# Altium project VCB20.PrjPCB (part 1 of 2)
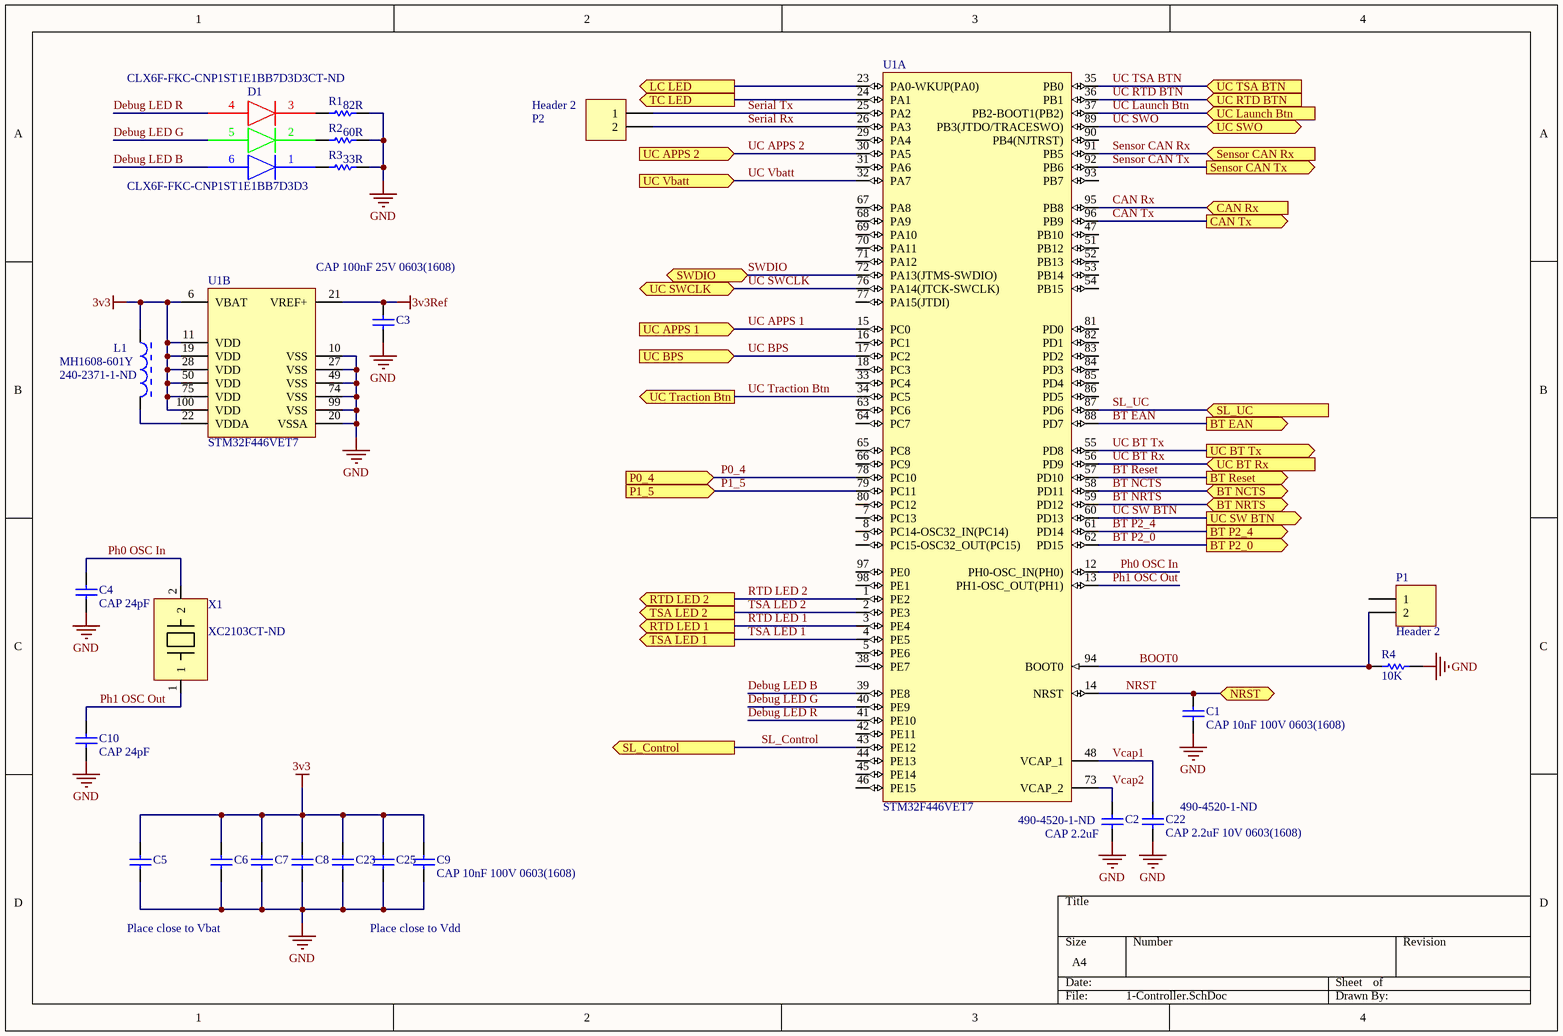
[diagram p0: 1-Controller.SchDoc]
10 sheets, 164 parts. Net scope: flat (ports and power ports of the same name join across sheets).
Board file: VCB2020_rev1.PcbDoc
Sheets:
  1-Controller.SchDoc
  2-Power.SchDoc
  4-PPS.SchDoc
  5-Connector.SchDoc
  8-Bluetooth.SchDoc
  9-Other_Inputs.SchDoc
  10-DashLEDs.SchDoc
  12-Dash_Inputs.SchDoc
  13-Fusing.SchDoc
  14-RegenSolenoid.SchDoc

## Sheet 1-Controller.SchDoc
size A4

### Parts
C1  CAP 10nF 100V 0603(1608)  [CAPC0603(1608)100_M]
C2  CAP 2.2uF  Supplier Part Number 1: 490-4520-1-ND  [CAPC0603(1608)55_N]
C3  CAP 100nF 25V 0603(1608)  [CAPC0603(1608)100_N]
C4  CAP 24pF  [CAPC0603(1608)100_N]
C5  CAP 10nF 100V 0603(1608)  [CAPC0603(1608)100_M]  (value not drawn)
C6  CAP 10nF 100V 0603(1608)  [CAPC0603(1608)100_M]  (value not drawn)
C7  CAP 10nF 100V 0603(1608)  [CAPC0603(1608)100_M]  (value not drawn)
C8  CAP 10nF 100V 0603(1608)  [CAPC0603(1608)100_M]  (value not drawn)
C9  CAP 10nF 100V 0603(1608)  [CAPC0603(1608)100_M]
C10  CAP 24pF  [CAPC0603(1608)100_N]
C22  CAP 2.2uF 10V 0603(1608)  Supplier Part Number 1: 490-4520-1-ND  [CAPC0603(1608)55_N]
C23  CAP 10nF 100V 0603(1608)  [CAPC0603(1608)100_M]  (value not drawn)
C25  CAP 10nF 100V 0603(1608)  [CAPC0603(1608)100_M]  (value not drawn)
D1  CLX6F-FKC-CNP1ST1E1BB7D3D3  Supplier Part Number 1: CLX6F-FKC-CNP1ST1E1BB7D3D3CT-ND  [CLX6C-FKB]
L1  MH1608-601Y  Supplier Part Number 1: 240-2371-1-ND  [BOUR-MH1608_V]
P1  Header 2  [HDR1X2]
P2  Header 2  [HDR1X2]
R1  82R  [RESC0603(1608)_N]
R2  60R  [RESC0603(1608)_N]
R3  33R  [RESC0603(1608)_N]
R4  10K  [RESC0603(1608)_N]
U1  STM32F446VET7  [STM-LQFP100_L]  (parts A,B of 2)
X1  Supplier Part Number 1: XC2103CT-ND  [2-SMD, No Lead]  (hidden comment: 7A-8.000MAAJ-T)

### Ports
BT EAN (out), BT NCTS (bidir), BT NRTS (bidir), BT P2_0 (out), BT P2_4 (out), BT Reset (out), CAN Rx (in), CAN Tx (out), LC LED (out), NRST (bidir), P0_4 (in), P1_5 (in), RTD LED 1 (out), RTD LED 2 (out), Sensor CAN Rx (in), Sensor CAN Tx (out), SL_Control (out), SL_UC (in), SWDIO (bidir), TC LED (out), TSA LED 1 (out), TSA LED 2 (out), UC APPS 1 (in), UC APPS 2 (in), UC BPS (in), UC BT Rx (in), UC BT Tx (out), UC Launch Btn (in), UC RTD BTN (in), UC SW BTN (out), UC SWCLK (bidir), UC SWO (bidir), UC Traction Btn (out), UC TSA BTN (in), UC Vbatt (in)

### Nets
3v3: C5.2 C6.2 C7.2 C8.2 C9.2 C23.2 C25.2 L1.1 U1.6(VBAT) U1.11(VDD) U1.19(VDD) U1.28(VDD) U1.50(VDD) U1.75(VDD) U1.100(VDD)
3v3Ref: C3.2 U1.21(VREF+)
GND: C1.1 C2.1 C3.1 C4.1 C5.1 C6.1 C7.1 C8.1 C9.1 C10.1 C22.1 C23.1 C25.1 R1.2 R2.2 R3.2 R4.2 U1.10(VSS) U1.20(VSSA) U1.27(VSS) U1.49(VSS) U1.74(VSS) U1.99(VSS)
BOOT0: P1.2 R4.1 U1.94(BOOT0)
BT EAN: U1.88(PD7) ; port BT EAN
BT NCTS: U1.58(PD11) ; port BT NCTS
BT NRTS: U1.59(PD12) ; port BT NRTS
BT P2_0: U1.62(PD15) ; port BT P2_0
BT P2_4: U1.61(PD14) ; port BT P2_4
BT Reset: U1.57(PD10) ; port BT Reset
CAN Rx: U1.95(PB8) ; port CAN Rx
CAN Tx: U1.96(PB9) ; port CAN Tx
Debug LED B: D1.6(B) U1.39(PE8)
Debug LED G: D1.5(G) U1.40(PE9)
Debug LED R: D1.4(R) U1.41(PE10)
LC LED: U1.23(PA0-WKUP(PA0)) ; port LC LED
NRST: C1.2 U1.14(NRST) ; port NRST
P0_4: U1.78(PC10) ; port P0_4
P1_5: U1.79(PC11) ; port P1_5
Ph0 OSC In: C4.2 U1.12(PH0-OSC_IN(PH0)) X1.2
Ph1 OSC Out: C10.2 U1.13(PH1-OSC_OUT(PH1)) X1.1
RTD LED 1: U1.3(PE4) ; port RTD LED 1
RTD LED 2: U1.1(PE2) ; port RTD LED 2
Sensor CAN Rx: U1.91(PB5) ; port Sensor CAN Rx
Sensor CAN Tx: U1.92(PB6) ; port Sensor CAN Tx
Serial Rx: P2.2 U1.26(PA3)
Serial Tx: P2.1 U1.25(PA2)
SL_Control: U1.43(PE12) ; port SL_Control
SL_UC: U1.87(PD6) ; port SL_UC
SWDIO: U1.72(PA13(JTMS-SWDIO)) ; port SWDIO
TC LED: U1.24(PA1) ; port TC LED
TSA LED 1: U1.4(PE5) ; port TSA LED 1
TSA LED 2: U1.2(PE3) ; port TSA LED 2
UC APPS 1: U1.15(PC0) ; port UC APPS 1
UC APPS 2: U1.30(PA5) ; port UC APPS 2
UC BPS: U1.17(PC2) ; port UC BPS
UC BT Rx: U1.56(PD9) ; port UC BT Rx
UC BT Tx: U1.55(PD8) ; port UC BT Tx
UC Launch Btn: U1.37(PB2-BOOT1(PB2)) ; port UC Launch Btn
UC RTD BTN: U1.36(PB1) ; port UC RTD BTN
UC SW BTN: U1.60(PD13) ; port UC SW BTN
UC SWCLK: U1.76(PA14(JTCK-SWCLK)) ; port UC SWCLK
UC SWO: U1.89(PB3(JTDO/TRACESWO)) ; port UC SWO
UC Traction Btn: U1.34(PC5) ; port UC Traction Btn
UC TSA BTN: U1.35(PB0) ; port UC TSA BTN
UC Vbatt: U1.32(PA7) ; port UC Vbatt
Vcap1: C22.2 U1.48(VCAP_1)
Vcap2: C2.2 U1.73(VCAP_2)
NetD1_1: D1.1(B) R3.1
NetD1_2: D1.2(G) R2.1
NetD1_3: D1.3(R) R1.1
NetL1_2: L1.2 U1.22(VDDA)

Not connected (* = marked no-connect by the designer): P1 1; U1 5(PE6) 7(PC13) 8(PC14-OSC32_IN(PC14)) 9(PC15-OSC32_OUT(PC15)) 16(PC1) 18(PC3) 29(PA4) 31(PA6) 33(PC4) 38(PE7) 42(PE11) 44(PE13) 45(PE14) 46(PE15) 47(PB10) 51(PB12) 52(PB13) 53(PB14) 54(PB15) 63(PC6) 64(PC7) 65(PC8) 66(PC9) 67(PA8) 68(PA9) 69(PA10) 70(PA11) 71(PA12) 77(PA15(JTDI)) 80(PC12) 81(PD0) 82(PD1) 83(PD2) 84(PD3) 85(PD4) 86(PD5) 90(PB4(NJTRST)) 93(PB7) 97(PE0) 98(PE1)

### Notes on the sheet
- Place close to Vbat
- Place close to Vdd

### Library data of the parts
C1 C5-C9 C23 C25 = CMP-1035-02326-1: CAP 10nF 100V ±20% 0603 (1608 Metric) Thickness 1mm SMD; Case-EIA: 0603; Tolerance: Â±20%; Case-Metric: 1608; Max Thickness: 1 mm; Technology: SMT; Value: 10nF; Rated Voltage: 100 V
C2 C22 = CMP-1035-02757-1: CAP 2.2uF 10V ±10% 0603 (1608 Metric) Thickness 0.55mm SMD; Case-EIA: 0603; Case-Metric: 1608; Tolerance: Â±10%; Value: 2.2uF; Rated Voltage: 10 V; Technology: SMT; Max Thickness: 0.55 mm; Supplier 1: Digi-Key
C3 = CMP-1035-02589-1: CAP 100nF 25V ±20% 0603 (1608 Metric) Thickness 1mm SMD; Case-EIA: 0603; Tolerance: Â±20%; Case-Metric: 1608; Value: 100nF; Max Thickness: 1 mm; Technology: SMT; Rated Voltage: 25 V
C4 C10 = CMP-1035-00843-1: CAP 24pF 16V ±2% 0603 (1608 Metric) Thickness 1mm SMD; Tolerance: Â±2%; Case-Metric: 1608; Case-EIA: 0603; Value: 24pF; Technology: SMT; Rated Voltage: 16 V; Max Thickness: 1 mm
D1 = LED - CLX6F-FKC-CNP1ST1E1BB7D3D3: Red, Green, Blue (RGB) 622nm Red, 530nm Green, 470nm Blue LED Indication - Discrete 2.1V Red, 2.7V Green, 3V Blue 6-SMD, J-Lead; ComponentLink1Description: Digikey; ComponentLink1URL: https://www.digikey.ca/product-detail/en/cree-inc/CLX6F-FKC-CNP1ST1E1BB7D3D3/CLX6F-FKC-CNP1ST1E1BB7D3D3CT-ND/6362814; Supplier 1: Digi-Key
L1 = CMP-2000-06698-1: Chip Bead, 600 Ohm, 1 A, -55 to 125 degC, 2-Pin SMD (0603), RoHS, Tape and Reel; Manufacturer: Bourns; Impedance @ Frequency: 600Ohm@100MHz; Online Catalog: MHSeries; DC Resistance (DCR) (Max): 200mOhm; Current Rating (Max): 1A; Other Names: MH1608-601YCT; EDA / CAD Models: DownloadfromAcceleratedDesigns; Filter Type: Power,SignalLine; Number of Lines: 1; Mounting Type: SurfaceMount; Manufacturer URL: http://www.bourns.com/; Package Description: 2-Pin Surface Mount Device, Body 1.6 x 0.8 mm; Category: Filters; Packaging: CutTape(CT); Family: FerriteBeadsandChips; Datasheet Version: 03/2015; Standard Package: 1; Mounting Technology: SurfaceMount; Package / Case: 0603(1608Metric); Datasheet URL: http://www.bourns.com/docs/Product-Datasheets/mh.pdf; Operating Temperature: -55°C~125°C; RoHS Information: MH1608SeriesMaterialDeclaration; Ratings: -; Package Reference: 0603; Series: MH; Supplier 1: Digi-Key
P1 P2 = Header 2: Header, 2-Pin; LatestRevisionDate: 17-Jul-2002; LatestRevisionNote: Re-released for DXP Platform.; Publisher: Altium Limited
R1 = CMP-1012-00048-1: 82R 0.1W 5% 0603 (1608 Metric)  SMD; Case-Metric: 1608; Value: 82.00 Ohm; Case-EIA: 0603; Technology: SMT; Tolerance: 5 %; Power: 0.1 W
R2 = CMP-1012-00372-1: 60R4 0.1W 1% 0603 (1608 Metric)  SMD; Case-EIA: 0603; Value: 60.40 Ohm; Case-Metric: 1608; Technology: SMT; Tolerance: 1 %; Power: 0.1 W
R3 = CMP-1012-00038-1: 33R 0.1W 5% 0603 (1608 Metric)  SMD; Value: 33.00 Ohm; Case-EIA: 0603; Case-Metric: 1608; Tolerance: 5 %; Technology: SMT; Power: 0.1 W
R4 = CMP-1012-00098-1: 10K 0.1W 5% 0603 (1608 Metric)  SMD; Case-EIA: 0603; Value: 10000.00 Ohm; Case-Metric: 1608; Technology: SMT; Tolerance: 5 %; Power: 0.1 W
U1 = CMP-0243-00221-1: ARM Cortex-M4 32-bit MCU+FPU, 512 KB Flash, 128 KB Internal RAM, 81 I/Os, 100-Pin LQFP, -40 to 105 degC, Tray; Supply Voltage(Vcc) min (V): 1.7; Operating Frequency(F) (Processor speed) (MHz): 180; D/A Converter: 2; FLASH Size (Prog) (kB): 512; I/Os (High Current): 81; Internal RAM Size (kB): 128; Core: ARM Cortex-M4; Packing: Tray; ComponentLink1URL: http://www.st.com/; DatasheetVersion: Rev. 6; Mounting Technology: Surface Mount; ComponentLink2Description: Datasheet; ComponentLink2URL: http://www.st.com/st-web-ui/static/active/en/resource/technical/document/datasheet/DM00141306.pdf; Package Reference: 100-Pin Low Profile Quad Flat Package, Body 14 x 14 mm, Pitch 0.5 mm; ComponentLink1Description: Manufacturer URL; Package Description: LQFP100; PartId: 1
X1 = 8MHz crystal, 7A-8.000MAAJ-T: Manufacturer: TXC CORPORATION; Frequency: 8MHz; Frequency Stability: ±30ppm; Load Capacitance: 18pF; ESR (Equivalent Series Resistance): 80 Ohm; Operating Mode: Fundamental; Manufacturer Part Number: 7A-8.000MAAJ-T; RoHS: RoHS Compliant; Category: Crystals, Oscillators, Resonators; Stock 1: 30692; Pricing 1: 1=1.12, 10=0.989, 50=0.9234, 100=0.8162, 500=0.77322 (CAD); Packaging: Cut Tape (CT); Part Status: Active; Type: MHz Crystal; Frequency Tolerance: ±30ppm; Operating Temperature: -20°C ~ 70°C; Ratings: -; Mounting Type: Surface Mount; Package / Case: 2-SMD, No Lead; Size / Dimension: 0.197" L x 0.126" W (5.00mm x 3.20mm); Height - Seated (Max): 0.053" (1.35mm); ComponentLink1URL: http://www.txccrystal.com/images/pdf/7a.pdf; ComponentLink1Description: http://www.txccrystal.com/images/pdf/7a.pdf; Supplier 1: Digi-Key

## Sheet 2-Power.SchDoc
size A4
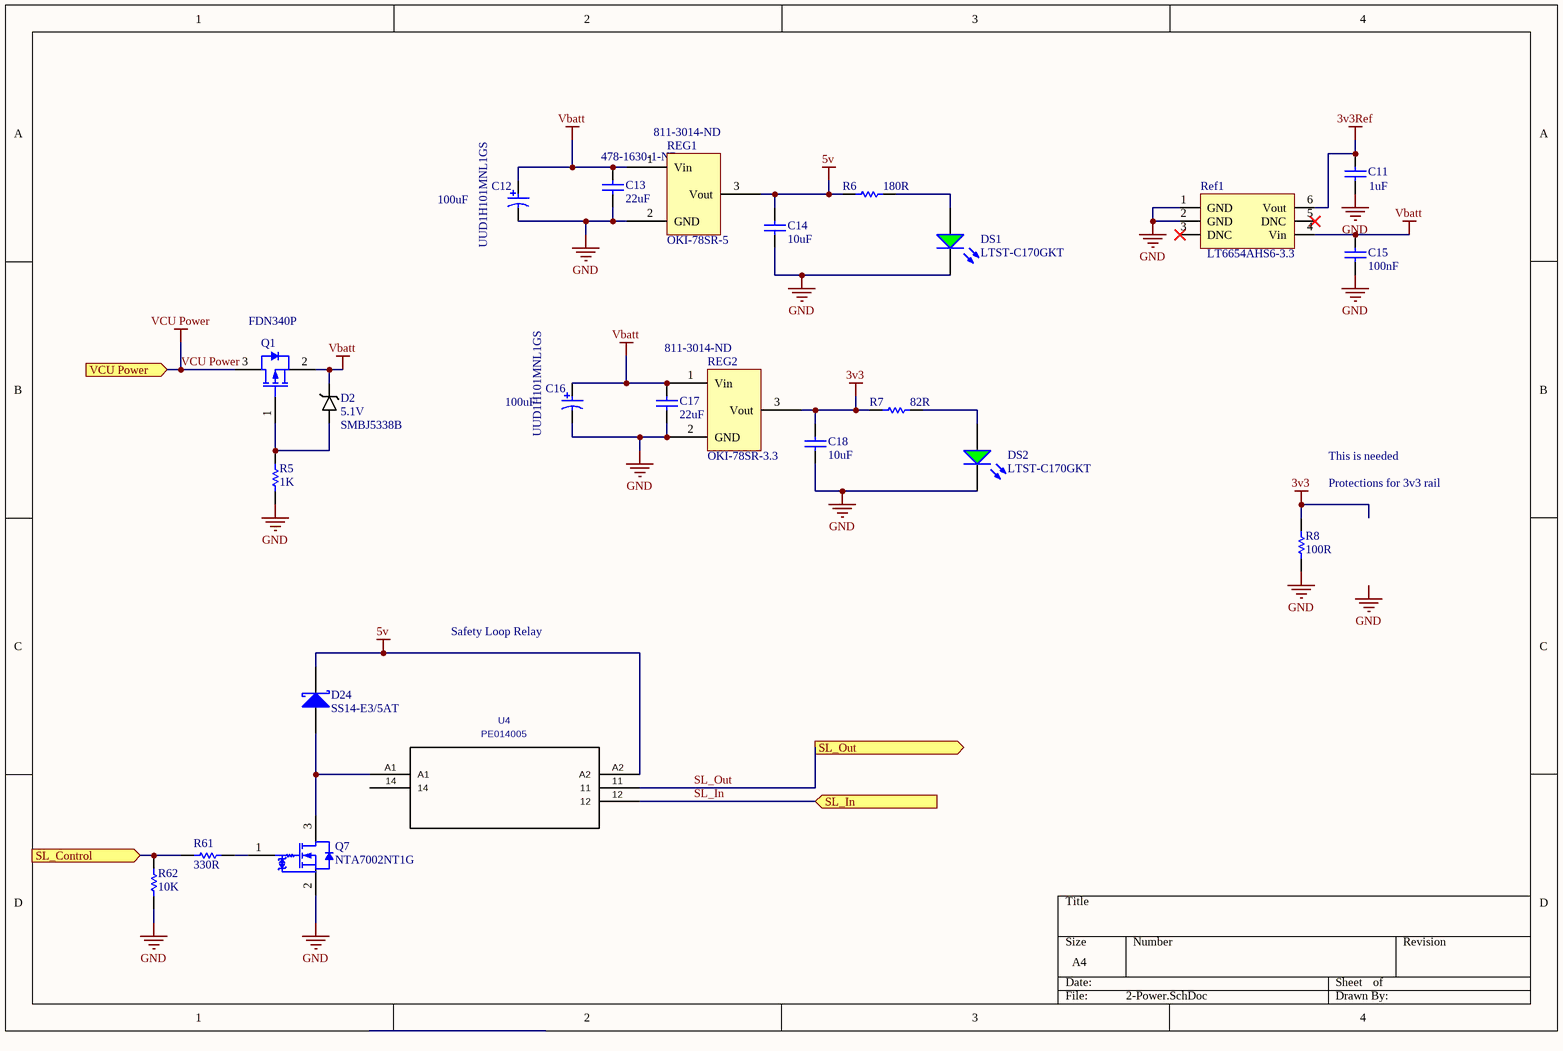
[diagram p1: 2-Power.SchDoc]

### Parts
C11  value 1uF  [1608[0603]]  (hidden comment: Cap)
C12  UUD1H101MNL1GS  [NIC-CAPA2-8X10_V]
C13  value 22uF  Supplier Part Number 1: 478-1630-1-ND  [C1210_M]  (hidden comment: Cap)
C14  value 10uF  [C1210_M]  (hidden comment: Cap)
C15  value 100nF  [1608[0603]]  (hidden comment: Cap)
C16  UUD1H101MNL1GS  [NIC-CAPA2-8X10_V]
C17  value 22uF  [C1210_M]  (hidden comment: Cap)
C18  value 10uF  [C1210_M]  (hidden comment: Cap)
D2  Reverse Voltage: 5.1V  Part Number: SMBJ5338B  [DO-214AA (SMB)]  (hidden comment: Zener Diode, 5.1V, 5W SMBJ5338B)
D24  SS14-E3/5AT  [VISH-DO-214AC-2_V]
DS1  LTST-C170GKT  [LTST-C170GKT_V]
DS2  LTST-C170GKT  [LTST-C170GKT_V]
Q1  FDN340P  [FAIR-SSOT3L-3_V]
Q7  NTA7002NT1G  [ONSC-SC-75-3-463-01_V]
R5  value 1K  [1608[0603]]  (hidden comment: Res1)
R6  value 180R  [1608[0603]]  (hidden comment: Res1)
R7  value 82R  [1608[0603]]  (hidden comment: Res1)
R8  100R  [RESC1206(3216)_M]
R61  value 330R  [1608[0603]]  (hidden comment: Res1)
R62  value 10K  [1608[0603]]  (hidden comment: Res1)
Ref1  LT6654AHS6-3.3  [TSOT-23 S6]
REG1  OKI-78SR-5  Supplier Part Number 2: 811-3014-ND  [OKI-78SR-5/1.5-W - Horizontal]
REG2  OKI-78SR-3.3  Supplier Part Number 2: 811-3014-ND  [Reg - TH, 3 pin, 100 mil Pitch, VTL]
U4  PE014005  [PE014005]

### Ports
SL_Control (in), SL_In (in), SL_Out (out), VCU Power (in)

### Nets
3v3: C18.2 R7.1 R8.2 REG2.3(Vout)
3v3Ref: C11.2 Ref1.6(Vout)
5v: C14.2 D24.2(K) R6.1 REG1.3(Vout) U4.A2
GND: C11.1 C12.2 C13.1 C14.1 C15.1 C16.2 C17.1 C18.1 DS1.2(K) DS2.2(K) Q7.2(S) R5.1 R8.1 R62.1 Ref1.1(GND) Ref1.2(GND) REG1.2(GND) REG2.2(GND)
Vbatt: C12.1 C13.2 C15.2 C16.1 C17.2 D2.K Q1.2(SOURCE) Ref1.4(Vin) REG1.1(Vin) REG2.1(Vin)
VCU Power: Q1.3(DRAIN) ; port VCU Power
SL_Control: R61.2 R62.2 ; port SL_Control
SL_In: U4.12 ; port SL_In
SL_Out: U4.11 ; port SL_Out
NetD2_A: D2.A Q1.1(GATE) R5.2
NetD24_1: D24.1(A) Q7.3(D) U4.A1
NetDS1_1: DS1.1(A) R6.2
NetDS2_1: DS2.1(A) R7.2
NetQ7_1: Q7.1(G) R61.1

Not connected (* = marked no-connect by the designer): Ref1 3(DNC)* 5(DNC)*; U4 14

### Notes on the sheet
- (near C12) 100uF
- (near C16) 100uF
- (near R8) Protections for 3v3 rail
- This is needed
- Safety Loop Relay
- Labels drawn without touching a wire or pin: GND

### Library data of the parts
C11 = Cap: Capacitor; Manufacturer: Murata Electronics North America; Manufacturer Part Number: GRM188R61E105KA12D; Capacitance: 1µF; Tolerance: ±10%; Voltage - Rated: 25V; Temperature Coefficient: X5R; RoHS: RoHS Compliant; Category: Capacitors; Stock 1: 4259407; Pricing 1: 1=0.15, 10=0.053, 50=0.0288, 100=0.0242, 250=0.01984, 500=0.01696, 1000=0.0132 (CAD); Packaging: Cut Tape (CT); Part Status: Active; Operating Temperature: -55°C ~ 85°C; Features: -; Ratings: -; Applications: General Purpose; Mounting Type: Surface Mount, MLCC; Package / Case: 0603 (1608 Metric); Size / Dimension: 0.063" L x 0.031" W (1.60mm x 0.80mm); Height - Seated (Max): -; Thickness (Max): 0.035" (0.90mm); Lead Spacing: -; Lead Style: -; ComponentLink1URL: http://www.murata.com/~/media/webrenewal/support/library/catalog/products/capacitor/mlcc/c02e.pdf; ComponentLink1Description: http://www.murata.com/~/media/webrenewal/support/library/catalog/products/capacitor/mlcc/c02e.pdf; Supplier 1: Digi-Key; Supplier Part Number 1: 587-2400-1-ND
C12 C16 = CMP-0687-00073-1: Aluminum Electrolytic Capacitor, UD Series, Low Impedance, 100 uF, 50 V, + / - 20%, -55 to 105 degC, Chip Type, 8 x 10 mm D x L, Pb-Free, Reel; Manufacturer: Nichicon; Rated Ripple Current (at 100kHz): 300 mA; Tolerance Rated Capacitance: -20 to 20%; Packing: Dia382mm Reel; Impedance: 0.34 Ohm; Rated Voltage: 50 V; Endurance Time: 5000 h; Rated Capacitance: 100 uF; Capacitance: 100µF; Voltage Rating: 50V; Lifetime @ Temp.: 5000 Hrs @ 105°C; Polarization: Polar; Ripple Current: 300mA; Surface Mount Land Size: 0.327" L x 0.327" W (8.30mm x 8.30mm); ComponentLink3Description: Package Specification; ComponentLink2Description: Datasheet; PackageReference: CAPAE-D8H10; RoHS: TRUE; Length: 10 mm; Mounting Technology: Surface Mount; PackageDescription: 2-Pin Surface Mount Device, Diameter 8 mm, Height 10 mm, Pitch 6.5 mm; DatasheetVersion: 08/2012; Diameter: 8 mm; ComponentLink3URL: http://products.nichicon.co.jp/en/pdf/XJA043/e-ud.pdf; ComponentLink1Description: Manufacturer URL; PartNumber: UUD1H101MNL1GS; ComponentLink2URL: http://products.nichicon.co.jp/en/pdf/XJA043/e-ud.pdf; ComponentLink1URL: http://www.nichicon.co.jp/; Supplier 1: Digi-Key; Supplier Part Number 1: 493-2306-1-ND; Manufacturer Part Number: UUD1H101MNL1GS; Category: Capacitors; Stock 1: 65948; Pricing 1: 1=0.92, 10=0.685, 25=0.5868, 50=0.5478, 100=0.4696, 250=0.43044 (CAD); Packaging: Cut Tape (CT); Part Status: Active; Tolerance: ±20%; ESR (Equivalent Series Resistance): -; Operating Temperature: -55°C ~ 105°C; Applications: General Purpose; Lead Spacing: -; Size / Dimension: 0.315" Dia (8.00mm); Height - Seated (Max): 0.394" (10.00mm); Mounting Type: Surface Mount; Package / Case: Radial, Can - SMD; ComponentLink4URL: http://nichicon-us.com/english/products/pdfs/e-uud.pdf; ComponentLink4Description: http://nichicon-us.com/english/products/pdfs/e-uud.pdf
C13 C17 = Cap: Capacitor; Manufacturer: Yageo; Manufacturer Part Number: CC1210MKX5R8BB226; Capacitance: 22µF; Tolerance: ±20%; Voltage - Rated: 25V; Temperature Coefficient: X5R; RoHS: RoHS Compliant; Category: Capacitors; Stock 1: 128; Pricing 1: 1=1, 10=0.703, 25=0.5996, 50=0.5314, 100=0.4628, 250=0.39424 (CAD); Packaging: Cut Tape (CT); Part Status: Active; Operating Temperature: -55°C ~ 85°C; Features: -; Ratings: -; Applications: General Purpose; Failure Rate: -; Mounting Type: Surface Mount, MLCC; Package / Case: 1210 (3225 Metric); Size / Dimension: 0.126" L x 0.098" W (3.20mm x 2.50mm); Height - Seated (Max): -; Thickness (Max): 0.110" (2.80mm); Lead Spacing: -; Lead Style: -; ComponentLink1URL: http://www.yageo.com/documents/recent/UPY-GPHC_X5R_4V-to-50V_23.pdf; ComponentLink1Description: http://www.yageo.com/documents/recent/UPY-GPHC_X5R_4V-to-50V_23.pdf; Supplier 1: Digi-Key
  C17: Supplier Part Number 1: 311-2056-1-ND
C14 C18 = Cap: Capacitor; Manufacturer: Yageo; Manufacturer Part Number: CC1210ZKY5V8BB106; Capacitance: 10µF; Tolerance: -20%, +80%; Voltage - Rated: 25V; Temperature Coefficient: Y5V (F); Supplier 1: Digi-Key; Supplier Part Number 1: 311-2063-1-ND; RoHS: RoHS Compliant; Category: Capacitors; Stock 1: 1156; Pricing 1: 1=0.47, 10=0.323, 25=0.258, 50=0.2154, 100=0.1829, 250=0.14528, 500=0.12912, 1000=0.11298 (CAD); Packaging: Cut Tape (CT); Part Status: Active; Operating Temperature: -30°C ~ 85°C; Features: -; Ratings: -; Applications: General Purpose; Failure Rate: -; Mounting Type: Surface Mount, MLCC; Package / Case: 1210 (3225 Metric); Size / Dimension: 0.126" L x 0.098" W (3.20mm x 2.50mm); Height - Seated (Max): -; Thickness (Max): 0.083" (2.10mm); Lead Spacing: -; Lead Style: -; ComponentLink1URL: http://www.yageo.com/documents/recent/UPY-GPHC_Y5V_6.3V-to-50V_7.pdf; ComponentLink1Description: http://www.yageo.com/documents/recent/UPY-GPHC_Y5V_6.3V-to-50V_7.pdf
C15 = Cap: Capacitor; Manufacturer: Yageo; Manufacturer Part Number: CC0603KRX7R9BB104; Capacitance: 0.10µF; Tolerance: ±10%; Voltage - Rated: 50V; Temperature Coefficient: X7R; Supplier 1: Digi-Key; Supplier Part Number 1: 311-1344-1-ND; RoHS: RoHS Compliant; Category: Capacitors; Stock 1: 4016262; Pricing 1: 1=0.15, 10=0.043, 25=0.0312, 50=0.0232, 100=0.0189, 250=0.0158, 500=0.01346, 1000=0.01059 (CAD); Packaging: Cut Tape (CT); Part Status: Active; Operating Temperature: -55°C ~ 125°C; Features: -; Ratings: -; Applications: General Purpose; Failure Rate: -; Mounting Type: Surface Mount, MLCC; Package / Case: 0603 (1608 Metric); Size / Dimension: 0.063" L x 0.031" W (1.60mm x 0.80mm); Height - Seated (Max): -; Thickness (Max): 0.035" (0.90mm); Lead Spacing: -; Lead Style: -; ComponentLink1URL: http://www.yageo.com/documents/recent/UPY-GPHC_X7R_6.3V-to-50V_16.pdf; ComponentLink1Description: http://www.yageo.com/documents/recent/UPY-GPHC_X7R_6.3V-to-50V_16.pdf
D24 = CMP-0549-00004-1: Schottky Barrier Rectifier, 40 V Maximum DC Blocking Voltage, -65 to 125 degC, 2-Pin SMA Case, RoHS; Manufacturer: Vishay Semiconductor; IFSM: 40 A; IF(AV): 1 A Max.; VRRM: 40 V Max.; VRMS: 28 V Max.; PackageReference: DO-214AC-2; RoHS: TRUE; DatasheetVersion: 12/17/2012; ComponentLink1Description: Manufacturer URL; ComponentLink2URL: http://www.vishay.com/docs/88746/ss12.pdf; PartNumber: SS14-E3/5AT; PackageVersion: Dec-12; Operating Temperature: -65 to 125 degC; ComponentLink3URL: http://www.vishay.com/docs/88746/ss12.pdf; PackageDescription: 2-Pin SMD, Body 4.245 x 2.665 mm, Height 2.29 mm; ComponentLink1URL: http://www.vishay.com/; ComponentLink3Description: Package Specification; ComponentLink2Description: Datasheet; Mounting Technology: Surface Mount; VDC: 40 V Max.
DS1 DS2 = CMP-1674-00002-5: LED Uni-Color Green, 100 mW, 120 mA, -55 to 85 degC, 2-Pin SMD, RoHS, Tape and Reel; Manufacturer: Lite-On; Lens Color: Colorless; Lens Transparency: Clear; Millicandela Rating: 6mcd; Lens Style/Size: Rectangle with Flat Top, 1.40mm x 1.25mm; Voltage - Forward (Vf) (Typ): 2.1V; Current - Test: 10mA; Viewing Angle: 130°; Wavelength - Dominant: 569nm; Wavelength - Peak: 565nm; ComponentLink1URL: http://www.us.liteon.com/; Height: 1.1 mm; PackageDescription: 2-Pin Surface Mount Device, Body 2 x 1.25 mm; RoHSCompliant: true; Package Quantity: 1; Packaging: Tape and Reel; Mount: Surface Mount; Min Operating Temperature: -55 degC; DatasheetVersion: 03/2003; Max Operating Temperature: 85 degC; ComponentLink1Description: Manufacturer URL; Pins: 2; Mounting Technology: Surface Mount; Length: 2 mm; Colour: Green; PackageReference: C170GKT; ComponentLink2URL: http://media.digikey.com/pdf/Data%20Sheets/Lite-On%20PDFs/LTST-C170GKT.pdf; ComponentLink2Description: Datasheet; Supplier 1: Digi-Key; Supplier Part Number 1: 160-1179-1-ND; Manufacturer Part Number: LTST-C170GKT; RoHS: RoHS Compliant; Category: Optoelectronics; Stock 1: 242288; Pricing 1: 1=0.48, 10=0.351, 25=0.2588, 100=0.1848, 250=0.12564, 500=0.11086, 1000=0.08684 (CAD); Part Status: Active; Color: Green; Mounting Type: Surface Mount; Features: -; Package / Case: 0805 (2012 Metric); Supplier Device Package: -; Size / Dimension: 2.00mm L x 1.25mm W; Height (Max): 1.10mm
Q1 = CMP-2100-03638-1: Single P-Channel, Logic Level, PowerTrench(R) MOSFET, 2 A, 20 V, -55 to 150 degC, 3-Pin SOT-23, RoHS, Tape and Reel; Manufacturer: Fairchild Semiconductor; Fall Time: 11ns; Current Rating: -2A; Turn-On Delay Time: 10ns; Drain to Source Breakdown Voltage: -20V; Drain to Source Resistance: 60mOhm; Gate to Source Voltage (Vgs): 8V; Threshold Voltage: -800mV; Rds On Max: 70mOhm; Package Version: Rev. 3, 05/2015; Turn-Off Delay Time: 27ns; Power Dissipation: 500mW; Number of Elements: 1; Drain to Source Voltage (Vdss): 20V; Rise Time: 9ns; Input Capacitance: 779pF; Continuous Drain Current (ID): 2A; Radiation Hardening: No; Contact Plating: Tin; Mount: SurfaceMount; REACH SVHC: NoSVHC; Manufacturer URL: https://www.fairchildsemi.com/; Width: 3.05mm; Height: 0.94mm; Voltage Rating (DC): -20V; Package Quantity: 1; Case/Package: SOT-23; Package Reference: SSOT3L; Lead Free: LeadFree; Datasheet Version: Rev. E1, 02/2007; Termination: SMD/SMT; Package URL: https://www.fairchildsemi.com/package-drawings/MA/MA03B.pdf; Packaging: TapeandReel; Number of Pins: 3; RoHSCompliant: true; Datasheet URL: https://www.fairchildsemi.com/datasheets/FD/FDN340P.pdf; Max Operating Temperature: 150degC; Element Configuration: Single; Min Operating Temperature: -55degC; Length: 2.92mm; Package Description: 3-Pin Small Outline Transistor, Body 2.92 x 1.4 mm, Pitch 0.95 mm; Max Power Dissipation: 500mW
Q7 = CMP-1058-00646-1: Small Signal MOSFET, 30 V, 154 mA, Single, N-Channel, Gate ESD Protection, 3-Pin SC75, Pb-Free, Tape and Reel; Manufacturer: On Semiconductor; Coss Typ (pF): 10; Crss Typ (pF): 3.5; Ciss Typ (pF): 11.5; V(BR)DSS Min (V): 30; Channel Polarity: N Channel; VGS(th) Max (V): 1.5; PD Max (W): 0.3; ID Max (A): 0.154; PackageReference: SC-75-3-463-01; ComponentLink3Description: Package Specification; PartNumber: NTA7002NT1G; PackageDescription: 3-Pin Small Outline Transistor, Body 1.6 x 0.8 mm, Pitch 0.5 mm; ComponentLink3URL: http://www.onsemi.com/pub_link/Collateral/463-01.PDF; Package Type: SC-75-3; Packing: Tape and Reel; Configuration: Single; PackageVersion: Rev. F, 07/2005; ComponentLink2Description: Datasheet; ComponentLink1URL: http://www.onsemi.com/; ComponentLink1Description: Manufacturer URL; DatasheetVersion: Rev. 5; VGS Max (V): 10; Mounting Technology: Surface Mount; RoHS: Pb-Free; ComponentLink2URL: http://www.onsemi.cn/pub_link/Collateral/NTA7002N-D.PDF
R5 = Res1: Resistor; Manufacturer: Panasonic Electronic Components; Manufacturer Part Number: ERJ-PA3F1001V; Tolerance: ±1%; Power (Watts): 0.25W, 1/4W; Temperature Coefficient: ±100ppm/°C; Supplier 1: Digi-Key; Supplier Part Number 1: P1.0KBYCT-ND; RoHS: RoHS Compliant; Category: Resistors; Stock 1: 56110; Pricing 1: 1=0.22, 10=0.198, 25=0.138, 50=0.1072, 100=0.0765, 250=0.05972, 500=0.04746, 1000=0.03368 (CAD); Packaging: Cut Tape (CT); Part Status: Active; Resistance (Ohms): 1k; Composition: Thick Film; Features: Automotive AEC-Q200, Pulse Withstanding; Operating Temperature: -55°C ~ 155°C; Package / Case: 0603 (1608 Metric); Supplier Device Package: 0603; Size / Dimension: 0.063" L x 0.031" W (1.60mm x 0.80mm); Height - Seated (Max): 0.022" (0.55mm); Number of Terminations: 2; Failure Rate: -; ComponentLink1URL: https://industrial.panasonic.com/cdbs/www-data/pdf/RDA0000/AOA0000C243.pdf; ComponentLink1Description: https://industrial.panasonic.com/cdbs/www-data/pdf/RDA0000/AOA0000C243.pdf
R6 = Res1: Resistor; Manufacturer: Yageo; Manufacturer Part Number: RC0603JR-07180RL; Resistance (Ohms): 180; Tolerance: ±5%; Power (Watts): 0.1W, 1/10W; Temperature Coefficient: ±100ppm/°C; Supplier 1: Digi-Key; Supplier Part Number 1: 311-180GRCT-ND; RoHS: RoHS Compliant; Category: Resistors; Stock 1: 201936; Pricing 1: 1=0.16, 10=0.016, 25=0.0112, 50=0.0084, 100=0.0062, 250=0.0048, 500=0.00382, 1000=0.00281 (CAD); Packaging: Cut Tape (CT); Part Status: Active; Composition: Thick Film; Features: Moisture Resistant; Operating Temperature: -55°C ~ 155°C; Package / Case: 0603 (1608 Metric); Supplier Device Package: 0603; Size / Dimension: 0.063" L x 0.031" W (1.60mm x 0.80mm); Height - Seated (Max): 0.022" (0.55mm); Number of Terminations: 2; Failure Rate: -; ComponentLink1URL: http://www.yageo.com/NewPortal/yageodocoutput?fileName=/pdf/R-Chip/PYu-RC_Group_51_RoHS_L_4.pdf; ComponentLink1Description: http://www.yageo.com/NewPortal/yageodocoutput?fileName=/pdf/R-Chip/PYu-RC_Group_51_RoHS_L_4.pdf
R7 = Res1: Resistor; Manufacturer: Yageo; Manufacturer Part Number: RC0603JR-0782RL; Resistance (Ohms): 82; Tolerance: ±5%; Power (Watts): 0.1W, 1/10W; Temperature Coefficient: ±100ppm/°C; Supplier 1: Digi-Key; Supplier Part Number 1: 311-82GRCT-ND; RoHS: RoHS Compliant; Category: Resistors; Stock 1: 72049; Pricing 1: 1=0.16, 10=0.016, 25=0.0112, 50=0.0084, 100=0.0062, 250=0.0048, 500=0.00382, 1000=0.00281 (CAD); Packaging: Cut Tape (CT); Part Status: Active; Composition: Thick Film; Features: Moisture Resistant; Operating Temperature: -55°C ~ 155°C; Package / Case: 0603 (1608 Metric); Supplier Device Package: 0603; Size / Dimension: 0.063" L x 0.031" W (1.60mm x 0.80mm); Height - Seated (Max): 0.022" (0.55mm); Number of Terminations: 2; Failure Rate: -; ComponentLink1URL: http://www.yageo.com/NewPortal/yageodocoutput?fileName=/pdf/R-Chip/PYu-RC_Group_51_RoHS_L_4.pdf; ComponentLink1Description: http://www.yageo.com/NewPortal/yageodocoutput?fileName=/pdf/R-Chip/PYu-RC_Group_51_RoHS_L_4.pdf
R8 = CMP-1014-00050-1: 100R 0.25W 5% 1206 (3216 Metric)  SMD; Case-EIA: 1206; Value: 100.00 Ohm; Case-Metric: 3216; Tolerance: 5 %; Power: 0.25 W; Technology: SMT
R61 R62 = Res1: Resistor; Manufacturer: Panasonic Electronic Components; Manufacturer Part Number: ERJ-PA3F1001V; Resistance (Ohms): 1k; Tolerance: ±1%; Power (Watts): 0.25W, 1/4W; Temperature Coefficient: ±100ppm/°C; Supplier 1: Digi-Key; Supplier Part Number 1: P1.0KBYCT-ND; RoHS: RoHS Compliant; Category: Resistors; Stock 1: 56110; Pricing 1: 1=0.22, 10=0.198, 25=0.138, 50=0.1072, 100=0.0765, 250=0.05972, 500=0.04746, 1000=0.03368 (CAD); Packaging: Cut Tape (CT); Part Status: Active; Composition: Thick Film; Features: Automotive AEC-Q200, Pulse Withstanding; Operating Temperature: -55°C ~ 155°C; Package / Case: 0603 (1608 Metric); Supplier Device Package: 0603; Size / Dimension: 0.063" L x 0.031" W (1.60mm x 0.80mm); Height - Seated (Max): 0.022" (0.55mm); Number of Terminations: 2; Failure Rate: -; ComponentLink1URL: https://industrial.panasonic.com/cdbs/www-data/pdf/RDA0000/AOA0000C243.pdf; ComponentLink1Description: https://industrial.panasonic.com/cdbs/www-data/pdf/RDA0000/AOA0000C243.pdf
Ref1 = LT6654AHS6-3.3: Manufacturer: Linear Technology; Reference Type: Series; Output Type: Fixed; Voltage - Output (Min/Fixed): 3.3V; Current - Output: 10mA; Tolerance: ±0.05%; Temperature Coefficient: 10ppm/°C; Noise - 0.1Hz to 10Hz: 1.7ppmp-p; Noise - 10Hz to 10kHz: 2ppmrms; Voltage - Input: 3.8 V ~ 36 V; Current - Supply: 600µA; Manufacturer Part Number: LT6654AHS6-3.3; Digikey Part Number: LT6654AHS6-3.3#TRMPBFCT-ND; Digikey Link: http://www.digikey.com/product-detail/en/linear-technology/LT6654AHS6-3.3-TRMPBF/LT6654AHS6-3.3-TRMPBFCT-ND/2485839; Supplier 1: Digi-Key; Supplier Part Number 1: LT6654AHS6-3.3#TRMPBFCT-ND; RoHS: RoHS Compliant; Category: Integrated Circuits (ICs); Stock 1: 1315; Pricing 1: 1=9.53, 25=8.508, 100=5.5596, 250=5.1048 (CAD); Packaging: Cut Tape (CT); Part Status: Active; Voltage - Output (Max): -; Current - Cathode: -; Operating Temperature: -40°C ~ 125°C (TA); Mounting Type: Surface Mount; Package / Case: SOT-23-6 Thin, TSOT-23-6; Supplier Device Package: TSOT-23-6; ComponentLink1URL: http://www.linear.com/docs/29677; ComponentLink1Description: http://www.linear.com/docs/29677
REG1 = OKI-78SR-5: 5V DCDC; Manufacturer: Murata Power Solutions Inc.; Manufacturer Part Number: OKI-78SR-3.3/1.5-W36H-C; Power (Watts) - Manufacture Series: 5W; Number of Outputs: 1; Voltage - Input (Min): 7V; Voltage - Input (Max): 36V; Current - Output (Max): 1.5A; Efficiency: 85.5%; Supplier 1: Digi-Key; Supplier Part Number 1: 811-2196-5-ND; Supplier 2: Digi-Key; RoHS: RoHS Compliant; Category: Power Supplies - Board Mount; Stock 2: 4108; Pricing 2: 1=6.31, 5=6.248, 10=6.205, 25=6.1168, 50=5.9262, 100=5.5449, 250=5.28716 (CAD); Packaging: Tray; Part Status: Active; Type: Linear Regulator Replacement; Voltage - Output 1: 5V; Voltage - Output 2: -; Voltage - Output 3: -; Voltage - Isolation: -; Applications: ITE (Commercial); Features: SCP; Mounting Type: Through Hole; Package / Case: 3-SIP Module; Size / Dimension: 0.65" L x 0.41" W x 0.30" H (16.5mm x 10.4mm x 7.6mm); Operating Temperature: -40°C ~ 85°C; ComponentLink1URL: http://power.murata.com/data/power/oki-78sr.pdf; ComponentLink1Description: http://power.murata.com/data/power/oki-78sr.pdf
REG2 = OKI-78SR-5: 3.3V DCDC; Manufacturer: Murata Power Solutions Inc.; Manufacturer Part Number: OKI-78SR-3.3/1.5-W36H-C; Power (Watts) - Manufacture Series: 5W; Number of Outputs: 1; Voltage - Input (Min): 7V; Voltage - Input (Max): 36V; Current - Output (Max): 1.5A; Efficiency: 85.5%; Supplier 1: Digi-Key; Supplier Part Number 1: 811-2196-5-ND; Supplier 2: Digi-Key; RoHS: RoHS Compliant; Category: Power Supplies - Board Mount; Stock 2: 4108; Pricing 2: 1=6.31, 5=6.248, 10=6.205, 25=6.1168, 50=5.9262, 100=5.5449, 250=5.28716 (CAD); Packaging: Tray; Part Status: Active; Type: Linear Regulator Replacement; Voltage - Output 1: 3.3V; Voltage - Output 2: -; Voltage - Output 3: -; Voltage - Isolation: -; Applications: ITE (Commercial); Features: SCP; Mounting Type: Through Hole; Package / Case: 3-SIP Module; Size / Dimension: 0.65" L x 0.41" W x 0.30" H (16.5mm x 10.4mm x 7.6mm); Operating Temperature: -40°C ~ 85°C; ComponentLink1URL: http://power.murata.com/data/power/oki-78sr.pdf; ComponentLink1Description: http://power.murata.com/data/power/oki-78sr.pdf
U4 = PE014005: Mfr_Name: Tyco Electronics; Value: PE014005; Copyright: Copyright (C) 2021 Ultra Librarian. All rights reserved.; Manufacturer_Part_Number: PE014005; Digi-Key_Part_Number_1: PB353-ND; Digi-Key_Part_Number_2: PB353-NDL
D2 = Zener Diode, 5.1V, 5W SMBJ5338B: Power: 5W

## Sheet 4-PPS.SchDoc
size A4
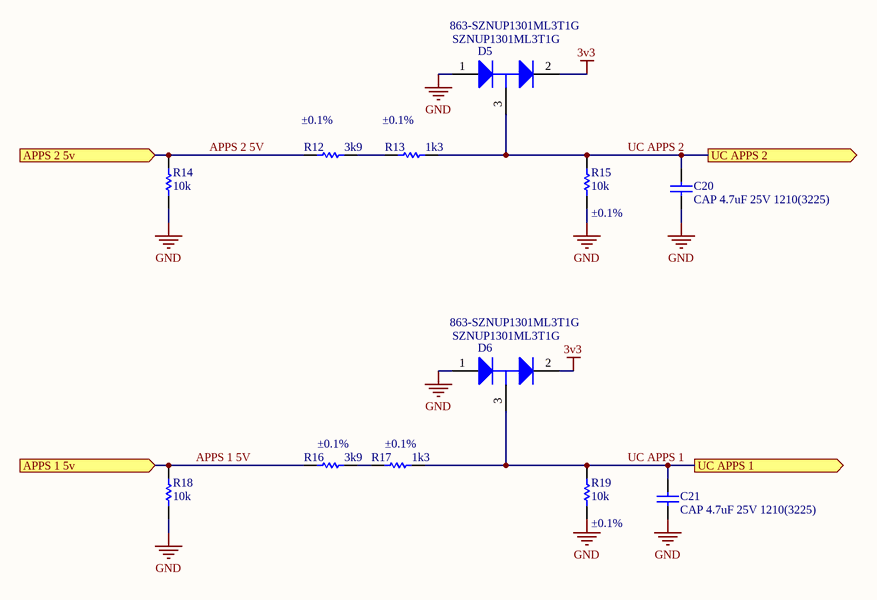
[diagram p2: 4-PPS.SchDoc]

### Parts
C20  CAP 4.7uF 25V 1210(3225)  [CAPC1210(3225)220_M]
C21  CAP 4.7uF 25V 1210(3225)  [CAPC1210(3225)220_M]
D5  SZNUP1301ML3T1G  Supplier Part Number 1: 863-SZNUP1301ML3T1G  [ONSC-SOT-23-3-318-08_V]
D6  SZNUP1301ML3T1G  Supplier Part Number 1: 863-SZNUP1301ML3T1G  [ONSC-SOT-23-3-318-08_V]
R12  value 3k9  Tolerance: ±0.1%  [1608[0603]]  (hidden comment: Res1)
R13  value 1k3  Tolerance: ±0.1%  [1608[0603]]  (hidden comment: Res1)
R14  value 10k  [1608[0603]]  (hidden comment: Res1)
R15  value 10k  Tolerance: ±0.1%  [1608[0603]]  (hidden comment: Res1)
R16  value 3k9  Tolerance: ±0.1%  [1608[0603]]  (hidden comment: Res1)
R17  value 1k3  Tolerance: ±0.1%  [1608[0603]]  (hidden comment: Res1)
R18  value 10k  [1608[0603]]  (hidden comment: Res1)
R19  value 10k  Tolerance: ±0.1%  [1608[0603]]  (hidden comment: Res1)

### Ports
APPS 1 5v (in), APPS 2 5v (in), UC APPS 1 (out), UC APPS 2 (out)

### Nets
3v3: D5.2(K) D6.2(K)
GND: C20.1 C21.1 D5.1(A) D6.1(A) R14.1 R15.1 R18.1 R19.1
APPS 1 5V: R16.1 R18.2 ; port APPS 1 5v
APPS 2 5V: R12.1 R14.2 ; port APPS 2 5v
UC APPS 1: C21.2 D6.3(K/A) R17.2 R19.2 ; port UC APPS 1
UC APPS 2: C20.2 D5.3(K/A) R13.2 R15.2 ; port UC APPS 2
NetR12_2: R12.2 R13.1
NetR16_2: R16.2 R17.1

### Library data of the parts
C20 C21 = CMP-1038-02151-2: CAP 4.7uF 25V ±10% 1210 (3225 Metric) Thickness 2.2mm SMD; Case-Metric: 3225; Case-EIA: 1210; Tolerance: Â±10%; Value: 4.7uF; Technology: SMT; Max Thickness: 2.2 mm; Rated Voltage: 25 V
D5 D6 = CMP-1063-00171-1: Low Capacitance Diode Array for ESD Protection in a Single Data Line, 3-Pin SOT-23, Pb-Free, Tape and Reel; Manufacturer: On Semiconductor; C Max (pF): 0.9; Direction: Bidirectional; V(BR) Min (V): 70; Number of Lines: 1; Mounting Technology: Surface Mount; PackageReference: SOT-23-3-318-08; DatasheetVersion: Rev. 6; PackageVersion: Rev. AP, 11/2009; RoHS: Pb-Free; ComponentLink1Description: Manufacturer URL; ComponentLink1URL: http://www.onsemi.com/; PackageDescription: 3-Pin Small Outline Transistor, Body 2.92 x 1.3 mm, Pitch 0.95 mm; PartNumber: SZNUP1301ML3T1G; Packing: Tape and Reel; ComponentLink3URL: http://www.onsemi.cn/pub_link/Collateral/318-08.PDF; ComponentLink3Description: Package Specification; VRWM Max (V): 70; ComponentLink2Description: Datasheet; ComponentLink2URL: http://www.onsemi.cn/pub_link/Collateral/NUP1301ML3T1-D.PDF; Supplier 1: Mouser
R12 R16 = Res1: Resistor; Manufacturer: Yageo; Manufacturer Part Number: RT0603BRD073K9L; Resistance (Ohms): 3.9k; Power (Watts): 0.1W, 1/10W; Temperature Coefficient: ±25ppm/°C; Supplier 1: Digi-Key; Supplier Part Number 1: YAG1656CT-ND; RoHS: RoHS Compliant; Category: Resistors; Stock 1: 10688; Pricing 1: 1=0.55, 10=0.464, 25=0.3376, 50=0.2446, 100=0.1814, 250=0.1392, 500=0.10966, 1000=0.07592 (CAD); Packaging: Cut Tape (CT); Part Status: Active; Composition: Thin Film; Features: Moisture Resistant; Operating Temperature: -55°C ~ 155°C; Package / Case: 0603 (1608 Metric); Supplier Device Package: 0603; Size / Dimension: 0.063" L x 0.031" W (1.60mm x 0.80mm); Height - Seated (Max): 0.022" (0.55mm); Number of Terminations: 2; Failure Rate: -; ComponentLink1URL: http://www.yageo.com/documents/recent/PYu-RT_1-to-0.05_RoHS_L_6.pdf; ComponentLink1Description: http://www.yageo.com/documents/recent/PYu-RT_1-to-0.05_RoHS_L_6.pdf
R13 R17 = Res1: Resistor; Manufacturer: Yageo; Manufacturer Part Number: RT0603BRD071K3L; Resistance (Ohms): 1.3k; Power (Watts): 0.1W, 1/10W; Temperature Coefficient: ±25ppm/°C; Supplier 1: Digi-Key; Supplier Part Number 1: YAG1565CT-ND; RoHS: RoHS Compliant; Category: Resistors; Stock 1: 2236; Pricing 1: 1=0.55, 10=0.464, 25=0.3376, 50=0.2446, 100=0.1814, 250=0.1392, 500=0.10966, 1000=0.07592 (CAD); Packaging: Cut Tape (CT); Part Status: Active; Composition: Thin Film; Features: Moisture Resistant; Operating Temperature: -55°C ~ 155°C; Package / Case: 0603 (1608 Metric); Supplier Device Package: 0603; Size / Dimension: 0.063" L x 0.031" W (1.60mm x 0.80mm); Height - Seated (Max): 0.022" (0.55mm); Number of Terminations: 2; Failure Rate: -; ComponentLink1URL: http://www.yageo.com/documents/recent/PYu-RT_1-to-0.05_RoHS_L_6.pdf; ComponentLink1Description: http://www.yageo.com/documents/recent/PYu-RT_1-to-0.05_RoHS_L_6.pdf
R14 R18 = Res1: Resistor; Manufacturer: Yageo; Manufacturer Part Number: RC0603JR-0710KL; Tolerance: ±5%; Power (Watts): 0.1W, 1/10W; Temperature Coefficient: ±100ppm/°C; Supplier 1: Digi-Key; Supplier Part Number 1: 311-10KGRCT-ND; RoHS: RoHS Compliant; Category: Resistors; Stock 1: 2936292; Pricing 1: 1=0.16, 10=0.016, 25=0.0112, 50=0.0084, 100=0.0062, 250=0.0048, 500=0.00382, 1000=0.00281 (CAD); Packaging: Cut Tape (CT); Part Status: Active; Resistance (Ohms): 10k; Composition: Thick Film; Features: Moisture Resistant; Operating Temperature: -55°C ~ 155°C; Package / Case: 0603 (1608 Metric); Supplier Device Package: 0603; Size / Dimension: 0.063" L x 0.031" W (1.60mm x 0.80mm); Height - Seated (Max): 0.022" (0.55mm); Number of Terminations: 2; Failure Rate: -; ComponentLink1URL: http://www.yageo.com/NewPortal/yageodocoutput?fileName=/pdf/R-Chip/PYu-RC_Group_51_RoHS_L_4.pdf; ComponentLink1Description: http://www.yageo.com/NewPortal/yageodocoutput?fileName=/pdf/R-Chip/PYu-RC_Group_51_RoHS_L_4.pdf
R15 R19 = Res1: Resistor; Manufacturer: Yageo; Manufacturer Part Number: RT0603BRD0710KL; Power (Watts): 0.1W, 1/10W; Temperature Coefficient: ±25ppm/°C; Supplier 1: Digi-Key; Supplier Part Number 1: YAG1236CT-ND; RoHS: RoHS Compliant; Category: Resistors; Stock 1: 2958; Pricing 1: 1=0.5, 10=0.42, 25=0.3048, 50=0.2212, 100=0.164, 250=0.12592, 500=0.0992, 1000=0.06867 (CAD); Packaging: Cut Tape (CT); Part Status: Active; Resistance (Ohms): 10k; Composition: Thin Film; Features: Moisture Resistant; Operating Temperature: -55°C ~ 155°C; Package / Case: 0603 (1608 Metric); Supplier Device Package: 0603; Size / Dimension: 0.063" L x 0.031" W (1.60mm x 0.80mm); Height - Seated (Max): 0.022" (0.55mm); Number of Terminations: 2; Failure Rate: -; ComponentLink1URL: http://www.yageo.com/documents/recent/PYu-RT_1-to-0.05_RoHS_L_6.pdf; ComponentLink1Description: http://www.yageo.com/documents/recent/PYu-RT_1-to-0.05_RoHS_L_6.pdf

## Sheet 5-Connector.SchDoc
size A4
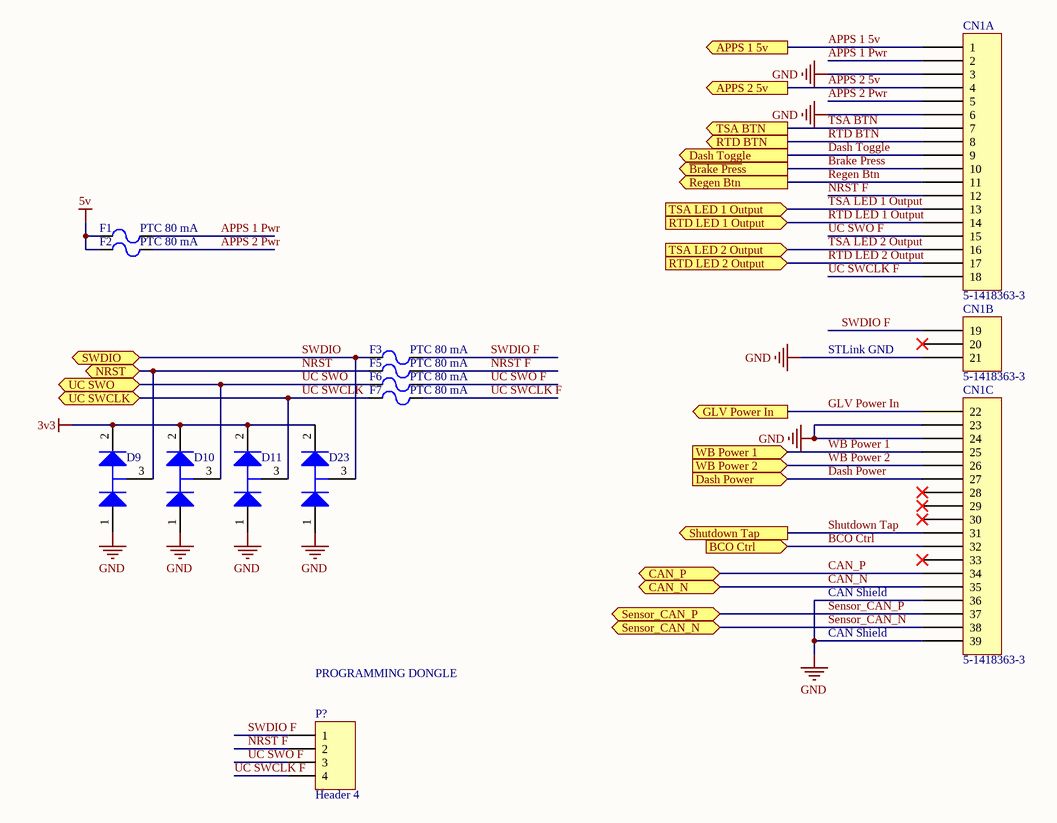
[diagram p3: 5-Connector.SchDoc]

### Parts
CN1  5-1418363-3  [5-1418363-3]  (parts A,B,C of 3)
D9  SZNUP1301ML3T1G  [ONSC-SOT-23-3-318-08_V]  (value not drawn)
D10  SZNUP1301ML3T1G  [ONSC-SOT-23-3-318-08_V]  (value not drawn)
D11  SZNUP1301ML3T1G  [ONSC-SOT-23-3-318-08_V]  (value not drawn)
D23  SZNUP1301ML3T1G  [ONSC-SOT-23-3-318-08_V]  (value not drawn)
F1  PTC 80 mA  [0603 fuse]
F2  PTC 80 mA  [0603 fuse]
F3  PTC 80 mA  [0603 fuse]
F5  PTC 80 mA  [0603 fuse]
F6  PTC 80 mA  [0603 fuse]
F7  PTC 80 mA  [0603 fuse]
P?  Header 4  [HDR1X4]

### Ports
APPS 1 5v (out), APPS 2 5v (out), BCO Ctrl (in), CAN_N (bidir), CAN_P (bidir), Dash Power (in), Dash Toggle (out), GLV Power In (out), NRST (bidir), Regen Btn (out), RTD BTN (out), RTD LED 1 Output (in), RTD LED 2 Output (in), Sensor_CAN_N (bidir), Sensor_CAN_P (bidir), Shutdown Tap (out), SWDIO (bidir), TSA BTN (out), TSA LED 1 Output (in), TSA LED 2 Output (in), UC SWCLK (bidir), UC SWO (bidir), WB Power 1 (in), WB Power 2 (in), ~{Brake Pres}s (out)

### Nets
3v3: D9.2(K) D10.2(K) D11.2(K) D23.2(K)
5v: F1.1 F2.1
GND: CN1.3 CN1.6 CN1.21 CN1.23 CN1.24 CN1.36 CN1.39 D9.1(A) D10.1(A) D11.1(A) D23.1(A)
~{Brake Pres}s: CN1.10 ; port ~{Brake Pres}s
APPS 1 5V: CN1.1 ; port APPS 1 5v
APPS 1 Pwr: CN1.2 F1.2
APPS 2 5V: CN1.4 ; port APPS 2 5v
APPS 2 Pwr: CN1.5 F2.2
BCO Ctrl: CN1.32 ; port BCO Ctrl
CAN_N: CN1.35 ; port CAN_N
CAN_P: CN1.34 ; port CAN_P
Dash Power: CN1.27 ; port Dash Power
Dash Toggle: CN1.9 ; port Dash Toggle
GLV Power In: CN1.22 ; port GLV Power In
NRST: D9.3(K/A) F5.1 ; port NRST
NRST F: CN1.12 F5.2 P?.2
Regen Btn: CN1.11 ; port Regen Btn
RTD BTN: CN1.8 ; port RTD BTN
RTD LED 1 Output: CN1.14 ; port RTD LED 1 Output
RTD LED 2 Output: CN1.17 ; port RTD LED 2 Output
Sensor_CAN_N: CN1.38 ; port Sensor_CAN_N
Sensor_CAN_P: CN1.37 ; port Sensor_CAN_P
Shutdown Tap: CN1.31 ; port Shutdown Tap
SWDIO: D23.3(K/A) F3.1 ; port SWDIO
SWDIO F: CN1.19 F3.2 P?.1
TSA BTN: CN1.7 ; port TSA BTN
TSA LED 1 Output: CN1.13 ; port TSA LED 1 Output
TSA LED 2 Output: CN1.16 ; port TSA LED 2 Output
UC SWCLK: D11.3(K/A) F7.1 ; port UC SWCLK
UC SWCLK F: CN1.18 F7.2 P?.4
UC SWO: D10.3(K/A) F6.1 ; port UC SWO
UC SWO F: CN1.15 F6.2 P?.3
WB Power 1: CN1.25 ; port WB Power 1
WB Power 2: CN1.26 ; port WB Power 2

Not connected (* = marked no-connect by the designer): CN1 20* 28* 29* 30* 33*

### Notes on the sheet
- STLink GND
- CAN Shield
- PROGRAMMING DONGLE

### Library data of the parts
CN1 = 5-1418363-3: Levyseal 90 degree 39 pin header
D9-D11 D23 = CMP-1063-00171-1: as D5 on sheet 4-PPS; Mounting Technology: Surface Mount; PackageReference: SOT-23-3-318-08; DatasheetVersion: Rev. 6; PackageVersion: Rev. AP, 11/2009; RoHS: Pb-Free; ComponentLink1Description: Manufacturer URL; ComponentLink1URL: http://www.onsemi.com/; PackageDescription: 3-Pin Small Outline Transistor, Body 2.92 x 1.3 mm, Pitch 0.95 mm; PartNumber: SZNUP1301ML3T1G; Packing: Tape and Reel; ComponentLink3URL: http://www.onsemi.cn/pub_link/Collateral/318-08.PDF; ComponentLink3Description: Package Specification; VRWM Max (V): 70; ComponentLink2Description: Datasheet; ComponentLink2URL: http://www.onsemi.cn/pub_link/Collateral/NUP1301ML3T1-D.PDF; Supplier 1: Mouser; Supplier Part Number 1: 863-SZNUP1301ML3T1G
F1-F3 F5-F7 = PTC fuse 80mA 0ZCM0008FF2G: 0ZCM0008FF2G; Supplier 1: Digi-Key; Supplier Part Number 1: 507-1817-1-ND
P? = Header 4: Header, 4-Pin; LatestRevisionDate: 17-Jul-2002; LatestRevisionNote: Re-released for DXP Platform.; Publisher: Altium Limited

## Sheet 8-Bluetooth.SchDoc
size A4
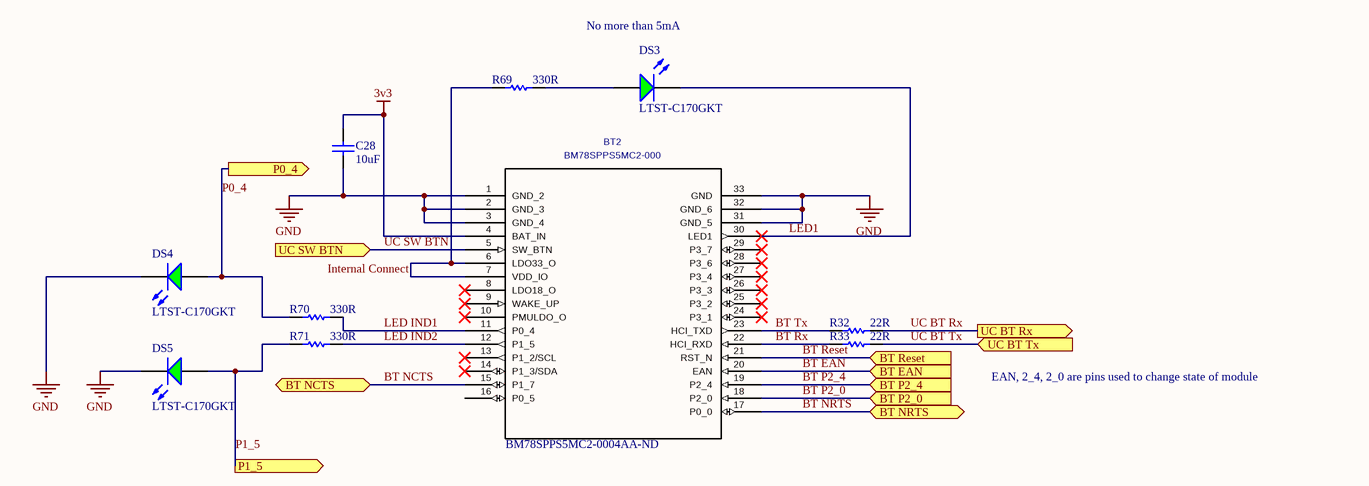
[diagram p4: 8-Bluetooth.SchDoc]

### Parts
BT2  BM78SPPS5MC2-000  Supplier Part Number 1: BM78SPPS5MC2-0004AA-ND  [BM78SPPS5MC2/NC2]
C28  value 10uF  [1608[0603]]  (hidden comment: Cap)
DS3  LTST-C170GKT  [LTST-C170GKT_V]
DS4  LTST-C170GKT  [LTST-C170GKT_V]
DS5  LTST-C170GKT  [LTST-C170GKT_V]
R32  value 22R  [1608[0603]]  (hidden comment: Res1)
R33  value 22R  [1608[0603]]  (hidden comment: Res1)
R69  value 330R  [1608[0603]]  (hidden comment: Res1)
R70  value 330R  [1608[0603]]  (hidden comment: Res1)
R71  value 330R  [1608[0603]]  (hidden comment: Res1)

### Ports
BT EAN (in), BT NCTS (bidir), BT NRTS (bidir), BT P2_0 (in), BT P2_4 (in), BT Reset (in), P0_4 (out), P1_5 (out), UC BT Rx (out), UC BT Tx (in), UC SW BTN (in)

### Nets
3v3: BT2.4(BAT_IN) C28.2
GND: BT2.1(GND_2) BT2.2(GND_3) BT2.3(GND_4) BT2.31(GND_5) BT2.32(GND_6) BT2.33(GND) C28.1 DS4.2(K) DS5.2(K)
BT EAN: BT2.20(EAN) ; port BT EAN
BT NCTS: BT2.15(P1_7) ; port BT NCTS
BT NRTS: BT2.17(P0_0) ; port BT NRTS
BT P2_0: BT2.18(P2_0) ; port BT P2_0
BT P2_4: BT2.19(P2_4) ; port BT P2_4
BT Reset: BT2.21(RST_N) ; port BT Reset
BT Rx: BT2.22(HCI_RXD) R33.1
BT Tx: BT2.23(HCI_TXD) R32.1
Internal Connect: BT2.6(LDO33_O) BT2.7(VDD_IO) R69.1
LED1: BT2.30(LED1) DS3.2(K)
LED IND1: BT2.11(P0_4) R70.2
LED IND2: BT2.12(P1_5) R71.2
P0_4: DS4.1(A) R70.1 ; port P0_4
P1_5: DS5.1(A) R71.1 ; port P1_5
UC BT Rx: R32.2 ; port UC BT Rx
UC BT Tx: R33.2 ; port UC BT Tx
UC SW BTN: BT2.5(SW_BTN) ; port UC SW BTN
NetDS3_1: DS3.1(A) R69.2

Not connected (* = marked no-connect by the designer): BT2 8(LDO18_O)* 9(WAKE_UP)* 10(PMULDO_O)* 13(P1_2/SCL)* 14(P1_3/SDA)* 16(P0_5) 24(P3_1)* 25(P3_2)* 26(P3_3)* 27(P3_4)* 28(P3_6)* 29(P3_7)*

### Notes on the sheet
- No more than 5mA
- EAN, 2_4, 2_0 are pins used to change state of module

### Library data of the parts
BT2 = BM78SPPS5MC2-000: Mfr_Name: Microchip; Manufacturer_Part_Number: BM78SPPS5MC2-0006AA; C: Copyright (C) 2021 Accelerated Designs. All rights reserved; Value: BM78SPPS5MC2-000; Copyright: Copyright (C) 2022 Ultra Librarian. All rights reserved.; Digi-Key_Part_Number_1: 150-BM78SPPS5MC2-0006AA-ND; Supplier 1: Digi-Key
C28 = Cap: as C15 on sheet 2-Power; Supplier 1: Digi-Key; Supplier Part Number 1: 311-1344-1-ND; RoHS: RoHS Compliant; Category: Capacitors; Stock 1: 4016262; Pricing 1: 1=0.15, 10=0.043, 25=0.0312, 50=0.0232, 100=0.0189, 250=0.0158, 500=0.01346, 1000=0.01059 (CAD); Packaging: Cut Tape (CT); Part Status: Active; Operating Temperature: -55°C ~ 125°C; Features: -; Ratings: -; Applications: General Purpose; Failure Rate: -; Mounting Type: Surface Mount, MLCC; Package / Case: 0603 (1608 Metric); Size / Dimension: 0.063" L x 0.031" W (1.60mm x 0.80mm); Height - Seated (Max): -; Thickness (Max): 0.035" (0.90mm); Lead Spacing: -; Lead Style: -; ComponentLink1URL: http://www.yageo.com/documents/recent/UPY-GPHC_X7R_6.3V-to-50V_16.pdf; ComponentLink1Description: http://www.yageo.com/documents/recent/UPY-GPHC_X7R_6.3V-to-50V_16.pdf
DS3-DS5 = CMP-1674-00002-5: as DS1 on sheet 2-Power; ComponentLink1URL: http://www.us.liteon.com/; Height: 1.1 mm; PackageDescription: 2-Pin Surface Mount Device, Body 2 x 1.25 mm; RoHSCompliant: true; Package Quantity: 1; Packaging: Tape and Reel; Mount: Surface Mount; Min Operating Temperature: -55 degC; DatasheetVersion: 03/2003; Max Operating Temperature: 85 degC; ComponentLink1Description: Manufacturer URL; Pins: 2; Mounting Technology: Surface Mount; Length: 2 mm; Colour: Green; PackageReference: C170GKT; ComponentLink2URL: http://media.digikey.com/pdf/Data%20Sheets/Lite-On%20PDFs/LTST-C170GKT.pdf; ComponentLink2Description: Datasheet; Supplier 1: Digi-Key; Supplier Part Number 1: 160-1179-1-ND; Manufacturer Part Number: LTST-C170GKT; RoHS: RoHS Compliant; Category: Optoelectronics; Stock 1: 242288; Pricing 1: 1=0.48, 10=0.351, 25=0.2588, 100=0.1848, 250=0.12564, 500=0.11086, 1000=0.08684 (CAD); Part Status: Active; Color: Green; Mounting Type: Surface Mount; Features: -; Package / Case: 0805 (2012 Metric); Supplier Device Package: -; Size / Dimension: 2.00mm L x 1.25mm W; Height (Max): 1.10mm
R32 R33 R69-R71 = Res1: Resistor; Manufacturer: Yageo; Manufacturer Part Number: RC0603JR-0722RL; Resistance (Ohms): 22; Tolerance: ±5%; Power (Watts): 0.1W, 1/10W; Temperature Coefficient: ±100ppm/°C; Supplier 1: Digi-Key; Supplier Part Number 1: 311-22GRCT-ND; RoHS: RoHS Compliant; Category: Resistors; Stock 1: 603781; Pricing 1: 1=0.16, 10=0.016, 25=0.0112, 50=0.0084, 100=0.0062, 250=0.0048, 500=0.00382, 1000=0.00281 (CAD); Packaging: Cut Tape (CT); Part Status: Active; Composition: Thick Film; Features: Moisture Resistant; Operating Temperature: -55°C ~ 155°C; Package / Case: 0603 (1608 Metric); Supplier Device Package: 0603; Size / Dimension: 0.063" L x 0.031" W (1.60mm x 0.80mm); Height - Seated (Max): 0.022" (0.55mm); Number of Terminations: 2; Failure Rate: -; ComponentLink1URL: http://www.yageo.com/NewPortal/yageodocoutput?fileName=/pdf/R-Chip/PYu-RC_Group_51_RoHS_L_4.pdf; ComponentLink1Description: http://www.yageo.com/NewPortal/yageodocoutput?fileName=/pdf/R-Chip/PYu-RC_Group_51_RoHS_L_4.pdf